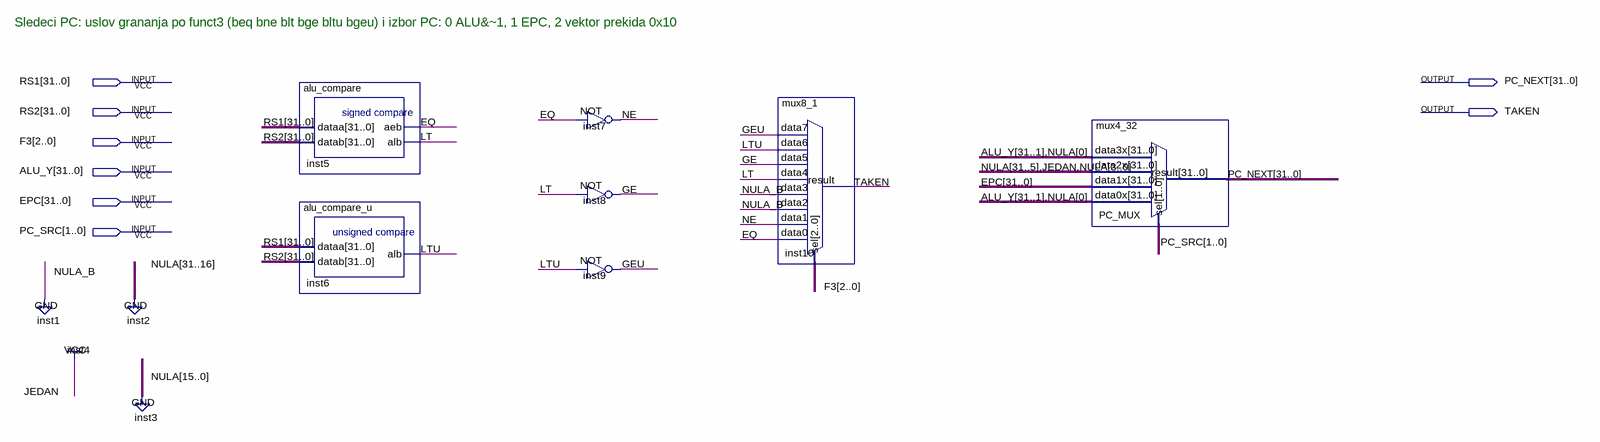
[diagram p0: schematic sheet]
// Quartus schematic pc_next.bdf as structural Verilog: 7 symbols, 8 pins
module pc_next (
  input  [31:0] RS1,
  input  [31:0] RS2,
  input  [2:0] F3,
  input  [31:0] ALU_Y,
  input  [31:0] EPC,
  input  [1:0] PC_SRC,
  output [31:0] PC_NEXT,
  output TAKEN
);

  wire EQ, GE, GEU, LT, LTU, NE;

  alu_compare inst5 (.dataa(RS1), .datab(RS2), .aeb(EQ), .alb(LT));
  alu_compare_u inst6 (.dataa(RS1), .datab(RS2), .alb(LTU));
  not inst7 (NE, EQ);
  not inst8 (GE, LT);
  not inst9 (GEU, LTU);
  mux8_1 inst10 (
    .data7(GEU), .data6(LTU), .data5(GE), .data4(LT), .data3(1'b0), .data2(1'b0), .data1(NE), .data0(EQ),
    .sel(F3), .result(TAKEN));
  mux4_32 PC_MUX (
    .data3x({ALU_Y[31:1], 1'b0}), .data2x(32'b00000000000000000000000000010000), .data1x(EPC),
    .data0x({ALU_Y[31:1], 1'b0}), .sel(PC_SRC), .result(PC_NEXT));

  // Notes on the sheet:
  //   Sledeci PC: uslov grananja po funct3 (beq bne blt bge bltu bgeu) i izbor PC: 0 ALU&~1, 1 EPC, 2 vektor prekida 0x10
endmodule
